# EAGLE design ax12 (EAGLE 9.3.0)
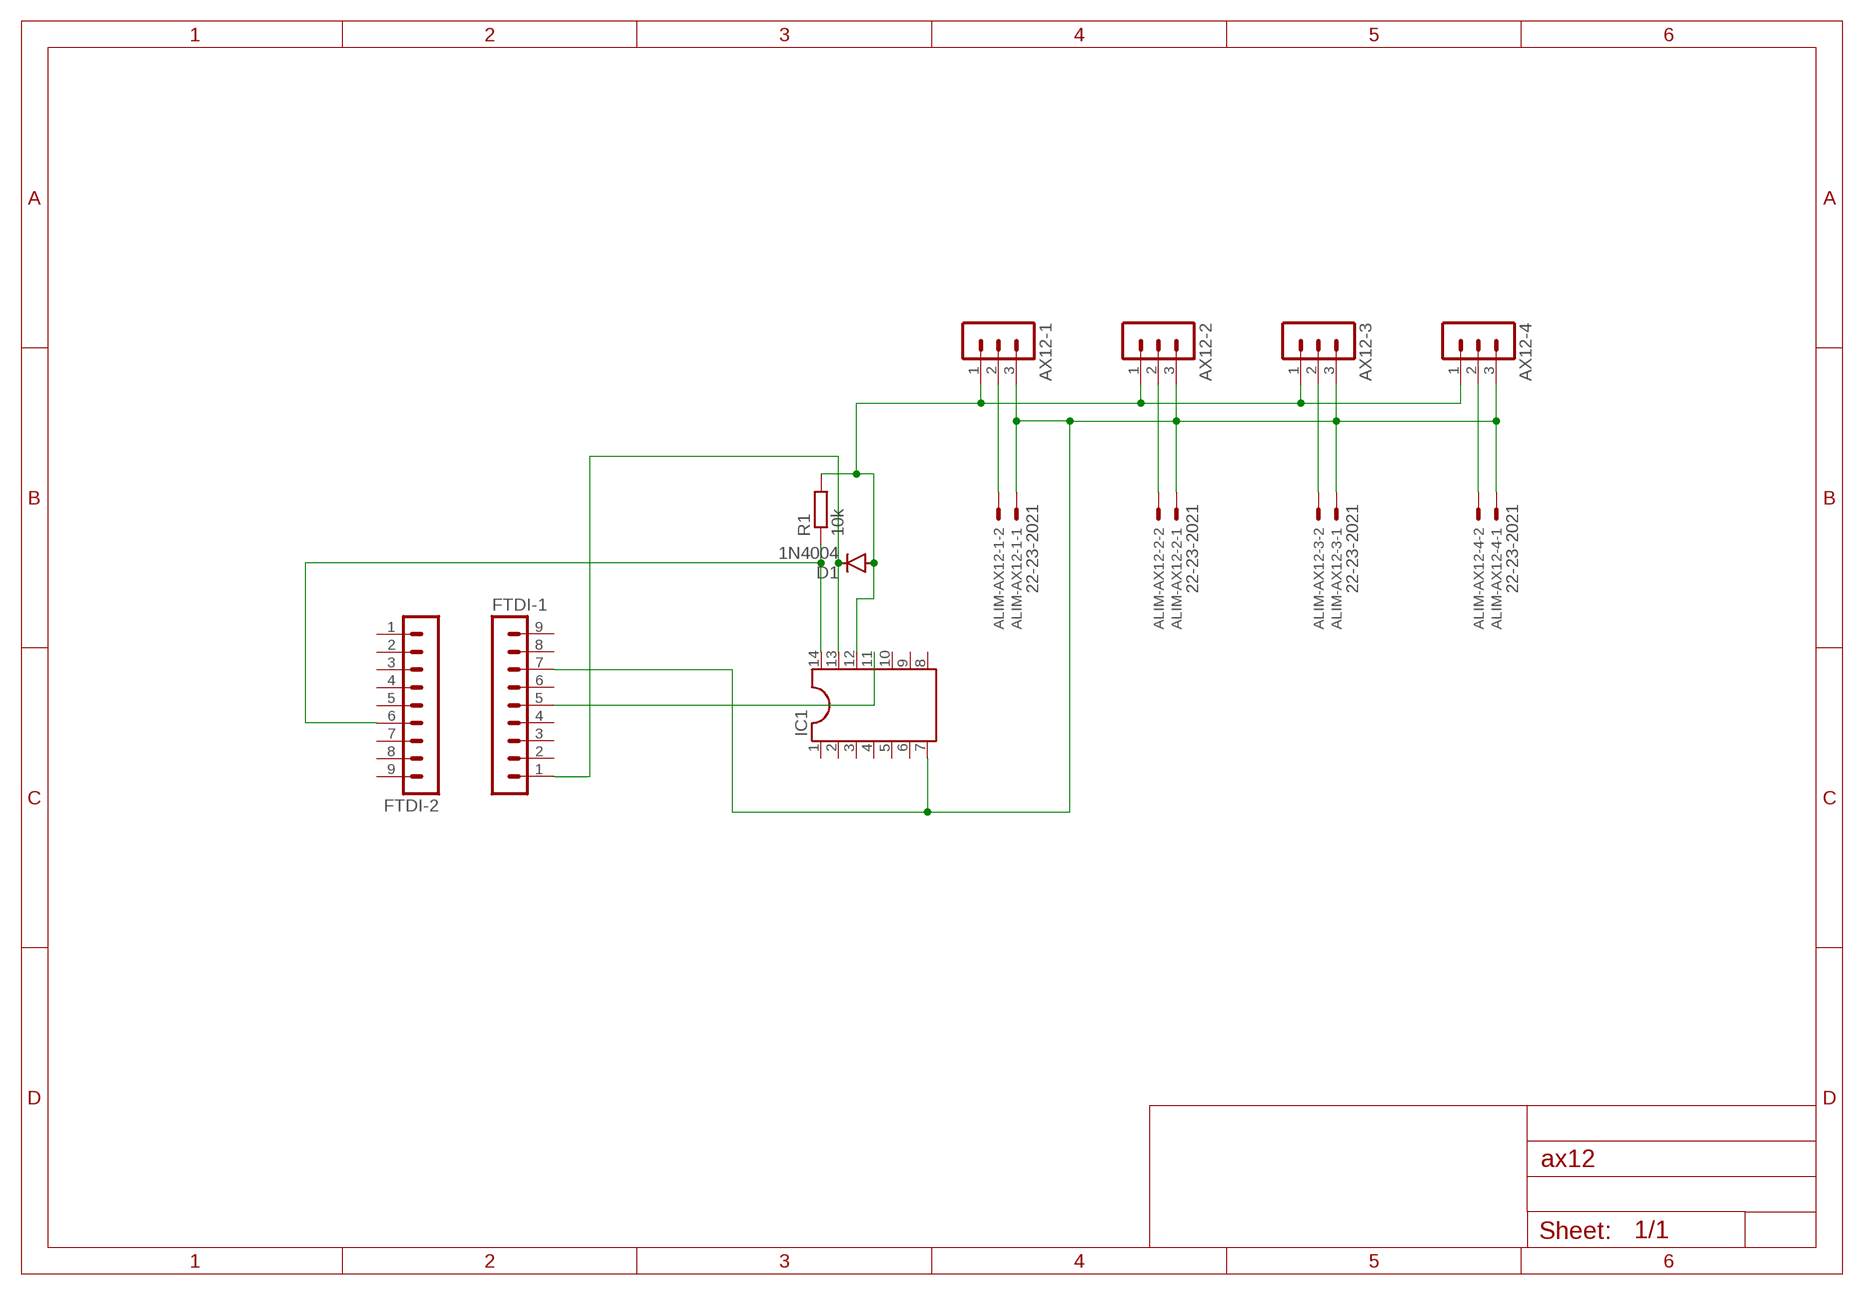
[diagram p0: schematic, sheet 1]

## Parts
ALIM-AX12-1  22-23-2021  [22-23-2021]
ALIM-AX12-2  22-23-2021  [22-23-2021]
ALIM-AX12-3  22-23-2021  [22-23-2021]
ALIM-AX12-4  22-23-2021  [22-23-2021]
AX12-1  MA03-1  [MA03-1]
AX12-2  MA03-1  [MA03-1]
AX12-3  MA03-1  [MA03-1]
AX12-4  MA03-1  [MA03-1]
D1  1N4004  [DO41-10]
FTDI-1  MA09-1  [MA09-1]
FTDI-2  MA09-1  [MA09-1]
IC1  DIL14  [DIL14]
R1  10k  R-EU_0207/12  [0207/12]

## Nets
5V: FTDI-2.6 IC1.14 R1.1
AX12-DATA: AX12-1.1 AX12-2.1 AX12-3.1 AX12-4.1 D1.A IC1.12 R1.2
GND: ALIM-AX12-1.1 ALIM-AX12-2.1 ALIM-AX12-3.1 ALIM-AX12-4.1 AX12-1.3 AX12-2.3 AX12-3.3 AX12-4.3 FTDI-1.7 IC1.7
N$1: ALIM-AX12-4.2 AX12-4.2
N$2: ALIM-AX12-3.2 AX12-3.2
N$3: ALIM-AX12-2.2 AX12-2.2
N$4: ALIM-AX12-1.2 AX12-1.2
RXD: FTDI-1.5 IC1.11
TXD: D1.C FTDI-1.1 IC1.13
Unconnected: FTDI-1.2 FTDI-1.3 FTDI-1.4 FTDI-1.6 FTDI-1.8 FTDI-1.9 FTDI-2.1 FTDI-2.2 FTDI-2.3 FTDI-2.4 FTDI-2.5 FTDI-2.7 FTDI-2.8 FTDI-2.9 IC1.1 IC1.2 IC1.3 IC1.4 IC1.5 IC1.6 IC1.8 IC1.9 IC1.10

## Library data of the parts
ALIM-AX12-1-ALIM-AX12-4 = con-molex:22-23-2021: .100" (2.54mm) Center Header - 2 Pin; MF: MOLEX; MPN: 22-23-2021; OC_FARNELL: 1462926; OC_NEWARK: 25C3832
AX12-1-AX12-4 = con-lstb:MA03-1: PIN HEADER; OC_FARNELL: unknown; OC_NEWARK: unknown
D1 = diode:1N4004: DIODE general purpose rectifier, 1 A
FTDI-1 FTDI-2 = con-lstb:MA09-1: PIN HEADER; OC_FARNELL: unknown; OC_NEWARK: unknown
IC1 = ic-package:DIL14: Dual In Line / Socket
R1 = rcl:R-EU_: RESISTOR, European symbol; SPICEPREFIX: R

## Board
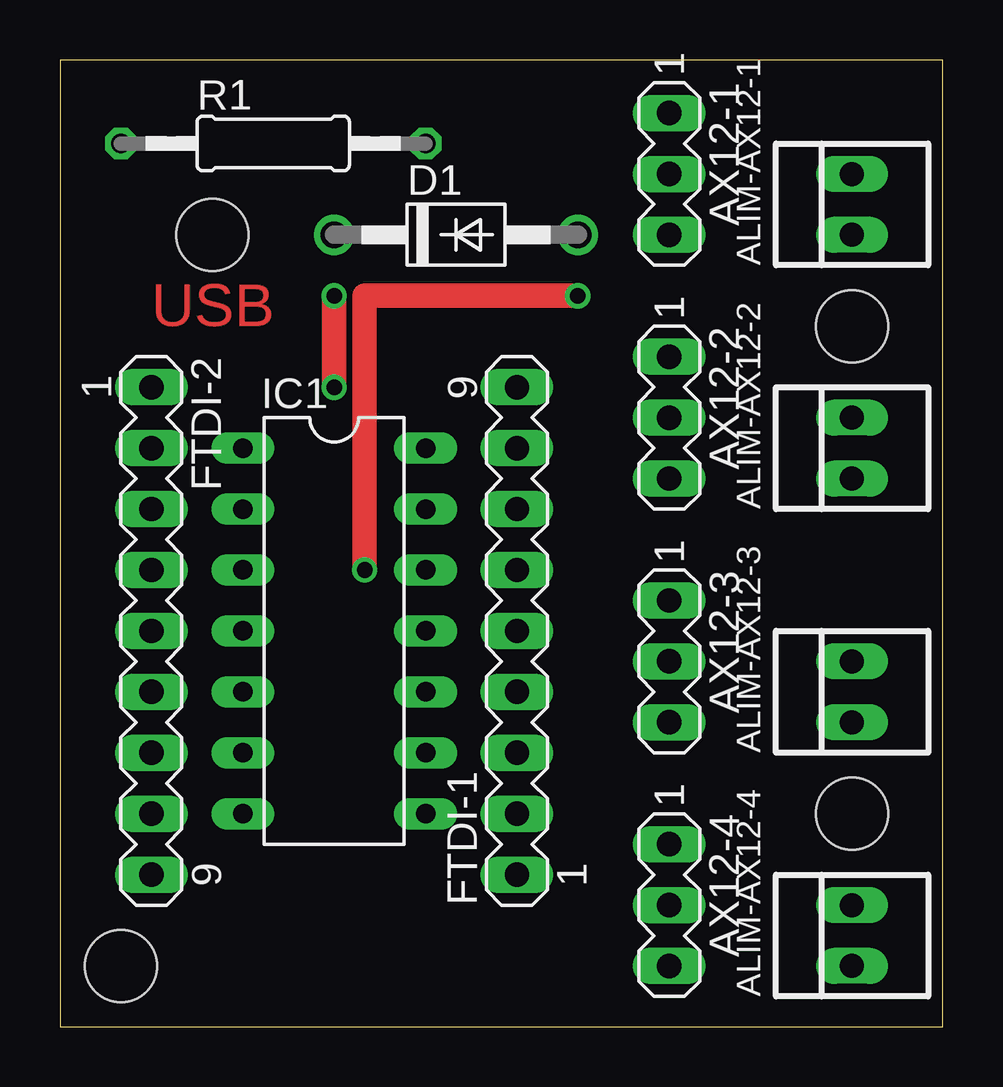
[diagram p1: board, top side]
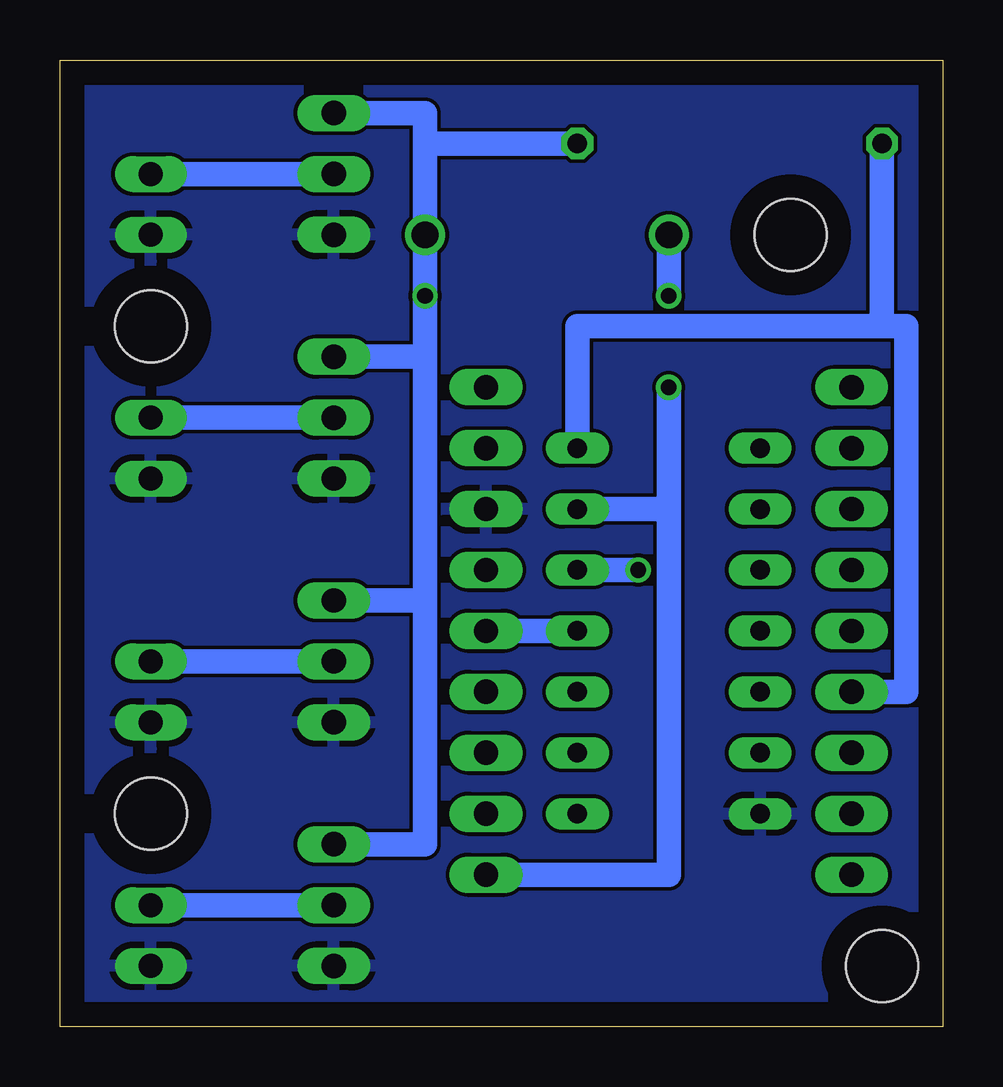
[diagram p2: board, bottom side, seen from below]

Size 36.81 x 40.31 mm. Coordinates in mm from the lower left corner, seen from the top.
Outline: 0,0 36.81,0 36.81,40.31 0,40.31 0,0
Copper layers (1*16): Top 0.035mm / dielectric 1.5mm / Bottom 0.035mm
Design rules "default": minimum track width 6mil, minimum drill 0.35mm, track to track 6mil, track to pad 6mil, pad to pad 6mil, via to via 6mil, smd to smd 6mil, copper to edge 40mil, drill to drill 6mil, minimum pad ring 10mil, minimum via ring 8mil, stop-mask expansion 4mil, vias tented up to drill 0mil, thermal gap 10mil
Holes 3 mm at 6.35,33.02 2.54,2.54 33.02,29.21 33.02,8.89

### Footprints (pad centres in the part's own frame; a part is rotated, then mirrored left to right if it is on the bottom)
22-23-2021 = drill 1 long: 1 -1.27,0; 2 1.27,0
MA03-1 = drill 1.016 long: 1 -2.54,0; 2 0,0; 3 2.54,0
DO41-10 = drill 1.118: A 5.08,0; C -5.08,0
MA09-1 = drill 1.016 long: 1 -10.16,0; 2 -7.62,0; 3 -5.08,0; 4 -2.54,0; 5 0,0; 6 2.54,0; 7 5.08,0; 8 7.62,0; 9 10.16,0
DIL14 = drill 0.813 long: 1 -7.62,-3.81; 2 -5.08,-3.81; 3 -2.54,-3.81; 4 0,-3.81; 5 2.54,-3.81; 6 5.08,-3.81; 7 7.62,-3.81; 8 7.62,3.81; 9 5.08,3.81; 10 2.54,3.81; 11 0,3.81; 12 -2.54,3.81; 13 -5.08,3.81; 14 -7.62,3.81
0207/12 = drill 0.813 octagon: 1 -6.35,0; 2 6.35,0

### Placement (x,y rotation side)
ALIM-AX12-1  33.02,34.29 90 top
ALIM-AX12-2  33.02,24.13 90 top
ALIM-AX12-3  33.02,13.97 90 top
ALIM-AX12-4  33.02,3.81 90 top
AX12-1  25.4,35.56 270 top
AX12-2  25.4,25.4 270 top
AX12-3  25.4,15.24 270 top
AX12-4  25.4,5.08 270 top
D1  16.51,33.02 0 top
FTDI-1  19.05,16.51 90 top
FTDI-2  3.81,16.51 270 top
IC1  11.43,16.51 270 top
R1  8.89,36.83 0 top

### Tracks (layer width: path | path; a pad name or v marks a point on that pad's centre or on a via)
5V
  Bottom 1.016: 2.54,29.21 15.24,29.21 IC1.14 | R1.1 2.54,29.21 | FTDI-2.6 1.52,13.97 1.52,29.21 2.54,29.21
AX12-DATA  (via drill 0.65)
  Top 1.016: v21.59,30.48 12.7,30.48 v12.7,19.05
  Bottom 1.016: R1.2 21.59,36.83 | 21.59,36.83 D1.A v21.59,30.48 21.59,27.94 | AX12-4.1 21.59,7.62 21.59,17.78 | 21.59,27.94 21.59,17.78 | AX12-3.1 21.59,17.78 | AX12-2.1 21.59,27.94 | AX12-1.1 21.59,38.1 21.59,36.83 | IC1.12 v12.7,19.05
GND
  pour Bottom: 0,40.64 36.83,40.64 36.83,0 0,0
N$1
  Bottom 1.016: ALIM-AX12-4.2 AX12-4.2
N$2
  Bottom 1.016: ALIM-AX12-3.2 AX12-3.2
N$3
  Bottom 1.016: ALIM-AX12-2.2 AX12-2.2
N$4
  Bottom 1.016: ALIM-AX12-1.2 AX12-1.2
RXD
  Bottom 1.016: IC1.11 FTDI-1.5
TXD  (via drill 0.65)
  Top 1.016: v11.43,30.48 v11.43,26.67
  Bottom 1.016: v11.43,26.67 11.43,21.59 | 11.43,21.59 11.43,6.35 FTDI-1.1 | D1.C v11.43,30.48 | IC1.13 11.43,21.59

### Text on the board
Top: USB